# Altium project РГР_ПСПД.PrjPcb
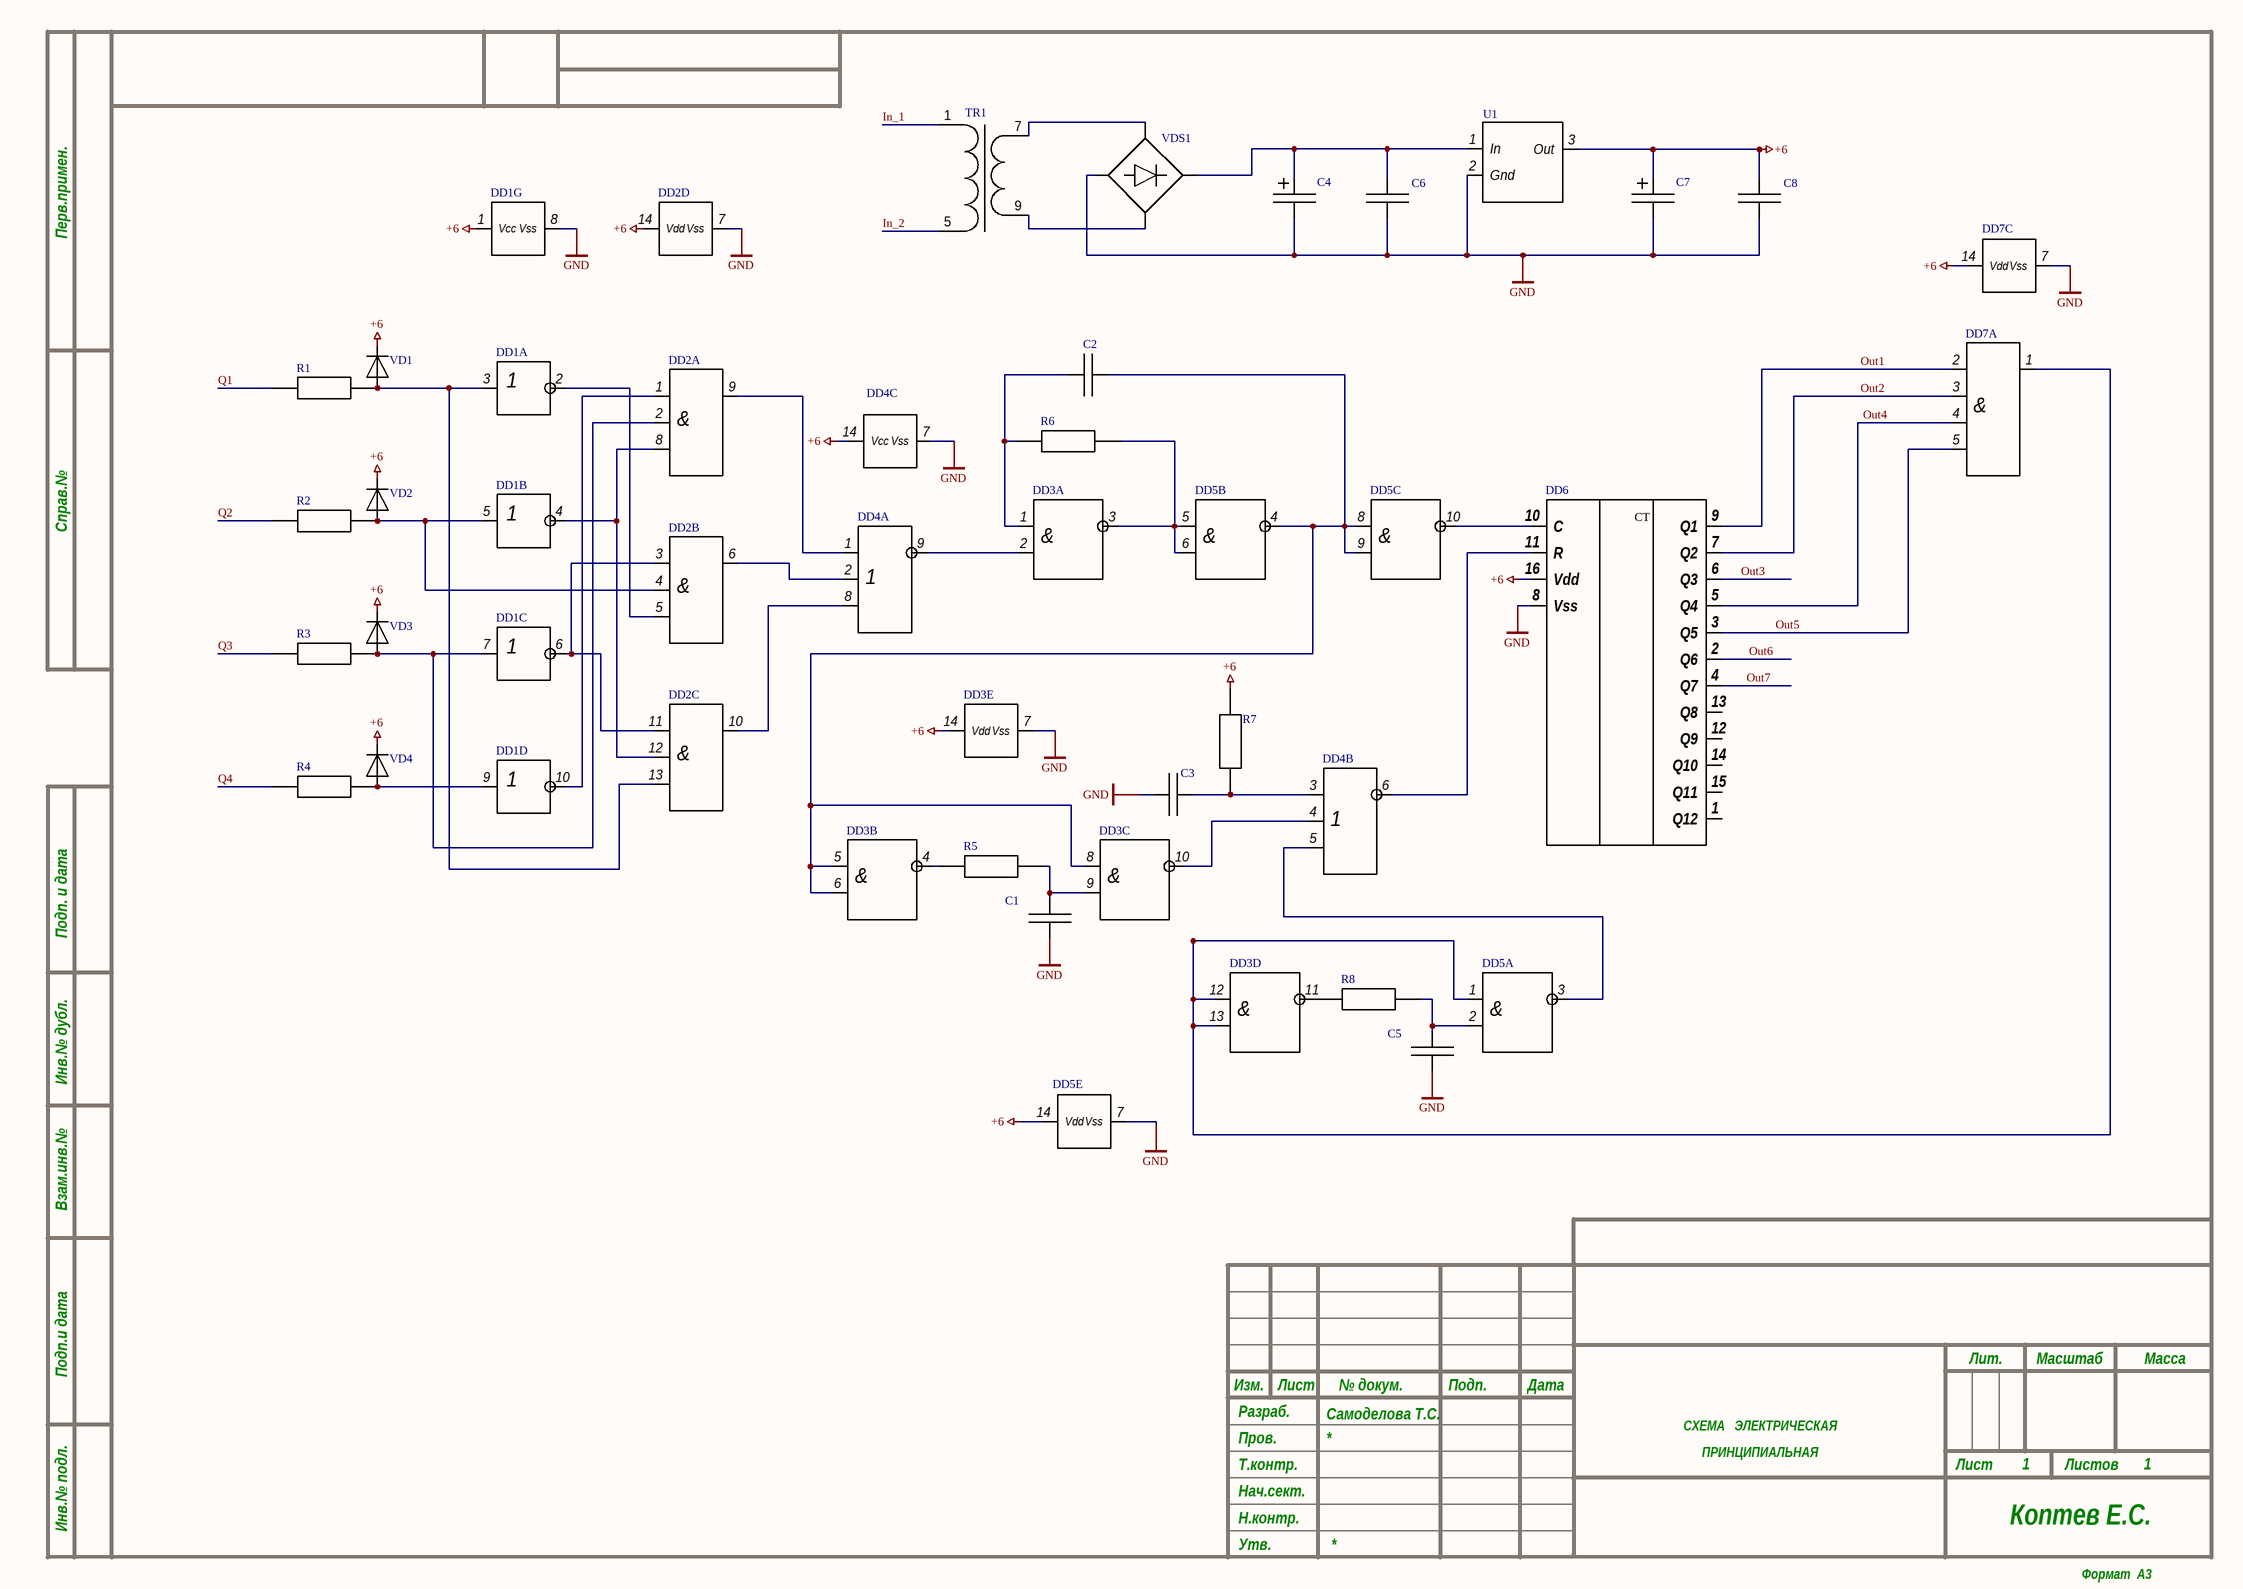
[diagram p0: Sheet1.SchDoc]
1 sheet, 30 parts. Net scope: global (net labels, ports and power ports of the same name join across sheets).
Board file: ПСПД.PcbDoc

## Sheet Sheet1.SchDoc
size 420 x 297 mm; Author: Самоделова Т.С.; CompanyName: Коптев Е.С.; SheetNumber: 1; SheetTotal: 1

### Parts
C1  160пФ  [160пФ]  (value not drawn)
C2  9.1нФ  [9.1нФ]  (value not drawn)
C3  9.1нФ  [9.1нФ]  (value not drawn)
C4  12мкФ  [12мкФ]  (value not drawn)
C5  160пФ  [160пФ]  (value not drawn)
C6  240нФ  [240нФ]  (value not drawn)
C7  1.2мкФ  [1.2мкФ]  (value not drawn)
C8  24нФ  [24нФ]  (value not drawn)
DD1  CD4069UBE  [DIP-16]  (value not drawn)  (parts A,B,C,D,G of 7)
DD2  CD4073BE  [DIP-14]  (value not drawn)  (parts A,B,C,D of 4)
DD3  CD4011BE  [DIP-14]  (value not drawn)  (parts A,B,C,D,E of 5)
DD4  CD4025BE  [DIP-14]  (value not drawn)  (parts A,B,C of 3)
DD5  CD4011BE  [DIP-14]  (value not drawn)  (parts A,B,C,E of 5)
DD6  КР1561ИЕ20  [DIP-16]  (value not drawn)
DD7  CD4082B  [DIP-14]  (value not drawn)  (parts A,C of 3)
R1  220к  [Резистор]  (value not drawn)
R2  220к  [Резистор]  (value not drawn)
R3  220к  [Резистор]  (value not drawn)
R4  220к  [Резистор]  (value not drawn)
R5  9.1к  [Резистор]  (value not drawn)
R6  9.1к  [Резистор]  (value not drawn)
R7  24к  [Резистор]  (value not drawn)
R8  9.1к  [Резистор]  (value not drawn)
TR1  ТПК-2, 9В  [ТПК-2, 9В]  (value not drawn)
U1  LM7806  [TO-220]  (value not drawn)
VD1  1N5818  [1N5818]  (value not drawn)
VD2  1N5818  [1N5818]  (value not drawn)
VD3  1N5818  [1N5818]  (value not drawn)
VD4  1N5818  [1N5818]  (value not drawn)
VDS1  2Д906Б  [2Д906Б]  (value not drawn)

### Nets
+6: C7.1 C8.1 DD1.1(Vcc) DD2.14(Vdd) DD3.14(Vdd) DD4.14(Vсс) DD5.14(Vdd) DD6.16(Vdd) DD7.14(Vdd) R7.2 U1.3(Out) VD1.2 VD2.2 VD3.2 VD4.2
GND: C1.2 C3.1 C4.2 C5.2 C6.2 C7.2 C8.2 DD1.8(Vss) DD2.7(Vss) DD3.7(Vss) DD4.7(Vss) DD5.7(Vss) DD6.8(Vss) DD7.7(Vss) U1.2(Gnd) VDS1.1
In_1: TR1.1
In_2: TR1.5
Out1: DD6.9(Q1) DD7.2
Out2: DD6.7(Q2) DD7.3
Out3: DD6.6(Q3)
Out4: DD6.5(Q4) DD7.4
Out5: DD6.3(Q5) DD7.5
Out6: DD6.2(Q6)
Out7: DD6.4(Q7)
Q1: R1.1
Q2: R2.1
Q3: R3.1
Q4: R4.1
NetC1_1: C1.1 DD3.9 R5.2
NetC2_1: C2.1 DD3.1 R6.1
NetC2_2: C2.2 DD3.5 DD3.6 DD3.8 DD5.4 DD5.8 DD5.9
NetC3_2: C3.2 DD4.3 R7.1
NetC4_1: C4.1 C6.1 U1.1(In) VDS1.2
NetC5_1: C5.1 DD5.2 R8.2
NetDD1_2: DD1.2 DD2.5
NetDD1_3: DD1.3 DD2.13 R1.2 VD1.1
NetDD1_4: DD1.4 DD2.8 DD2.12
NetDD1_5: DD1.5 DD2.4 R2.2 VD2.1
NetDD1_6: DD1.6 DD2.3 DD2.11
NetDD1_7: DD1.7 DD2.2 R3.2 VD3.1
NetDD1_9: DD1.9 R4.2 VD4.1
NetDD1_10: DD1.10 DD2.1
NetDD2_6: DD2.6 DD4.2
NetDD2_9: DD2.9 DD4.1
NetDD2_10: DD2.10 DD4.8
NetDD3_2: DD3.2 DD4.9
NetDD3_3: DD3.3 DD5.5 DD5.6 R6.2
NetDD3_4: DD3.4 R5.1
NetDD3_10: DD3.10 DD4.4
NetDD3_11: DD3.11 R8.1
NetDD3_12: DD3.12 DD3.13 DD5.1 DD7.1
NetDD4_5: DD4.5 DD5.3
NetDD4_6: DD4.6 DD6.11(R)
NetDD5_10: DD5.10 DD6.10(C)
NetTR1_7: TR1.7 VDS1.4
NetTR1_9: TR1.9 VDS1.3

Not connected (* = marked no-connect by the designer): DD6 1(Q12) 12(Q9) 13(Q8) 14(Q10) 15(Q11)

### Notes on the sheet
- Перв.примен.
- Справ.№
- Подп. и дата
- Инв.№ дубл.
- Взам.инв.№
- Подп.и дата
- Разраб.
- Изм.
- Лист
- № докум.
- Подп.
- Дата
- Лит.
- Масштаб
- Масса
- Т.контр.
- Пров.
- СХЕМА   ЭЛЕКТРИЧЕСКАЯ
- ПРИНЦИПИАЛЬНАЯ
- Листов
- Инв.№ подл.
- Утв.
- Н.контр.
- Нач.сект.
- Формат  A3
- (in symbol CD4011BE, part A) &
- (in symbol CD4011BE, part B) &
- (in symbol CD4011BE, part C) &
- (in symbol CD4011BE, part D) &
- (in symbol CD4073BE, part A) &
- (in symbol CD4073BE, part B) &
- (in symbol CD4073BE, part C) &
- (in symbol CD4082B, part A) &
- (in symbol КР1561ИЕ20) СТ

### Library data of the parts
C1-C3 C5 C6 C8 = Конденсатор
C4 C7 = Электролитический конднсатор
DD1 = CD4069UBE: Не
DD2 = CD4073BE: 3И
DD3 DD5 = CD4011BE: 2И-НЕ
DD4 = CD4025BE: 3ИЛИ-НЕ
DD6 = КР1561ИЕ20: Счётчик
DD7 = CD4082B: 4И
R1-R8 = CF-50 (С1-4): Резистор
TR1 = ТПК-2, 9В: Трансформатор
U1 = LM7806: Стабилизатор
VD1-VD4 = 1N5818: Диод
VDS1 = 2Д906Б: Диодный мост